# Altium schematic sheet power.SchDoc
size 209 x 297 mm; SheetNumber: 2; SheetTotal: 2
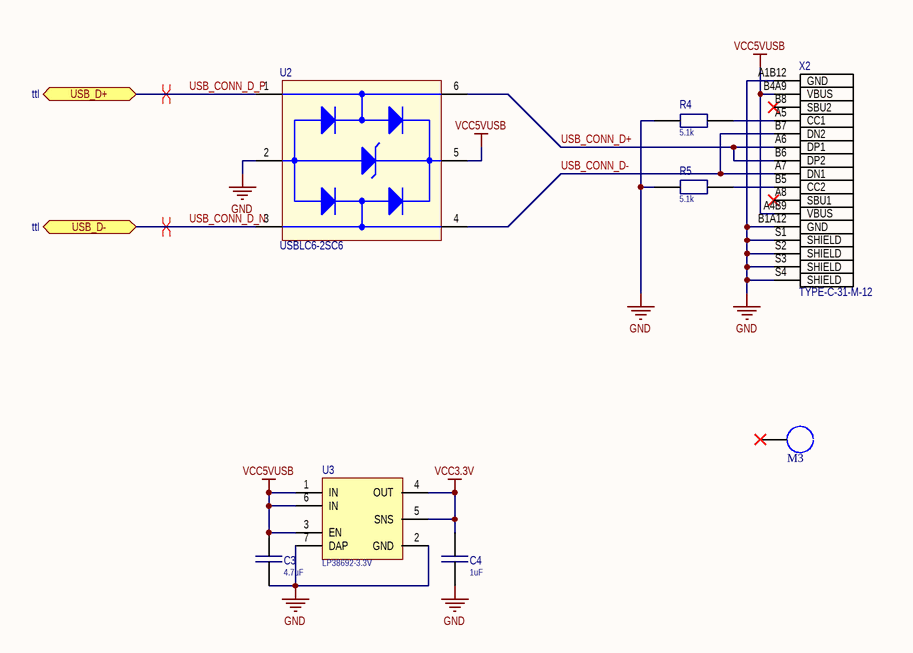
[diagram p0: power.SchDoc]

## Parts
*1  M3  [M3]  (no BOM)
C3  4.7uF  [C_0603]
C4  1uF  [C_0603]
R4  5.1k  [R_0603]
R5  5.1k  [R_0603]
U2  USBLC6-2SC6  [SOT95P280X145-6N]
U3  LP38692-3.3V  [WSON-6]
X2  TYPE-C-31-M-12  [HRO_TYPE-C-31-M-12]

## Ports
USB_D+ (bidir, see ttl), USB_D- (bidir, see ttl)

## Nets
GND: C3.1 C4.1 R4.1 R5.1 U2.2(GND) U3.2(GND) U3.7(DAP) X2.A1B12(GND) X2.B1A12(GND) X2.S1(SHIELD) X2.S2(SHIELD) X2.S3(SHIELD) X2.S4(SHIELD)
VCC3.3V: C4.2 U3.4(OUT) U3.5(SNS)
VCC5VUSB: C3.2 U2.5(VBUS) U3.1(IN) U3.3(EN) U3.6(IN) X2.A4B9(VBUS) X2.B4A9(VBUS)
USB_CONN_D+: U2.6(I/O1_OUT) X2.A6(DP1) X2.B6(DP2)
USB_CONN_D-: U2.4(I/O2_OUT) X2.A7(DN1) X2.B7(DN2)
USB_CONN_D_N: U2.3(I/O2_IN) ; port USB_D-
USB_CONN_D_P: U2.1(I/O1_IN) ; port USB_D+
NetR4_2: R4.2 X2.A5(CC1)
NetR5_2: R5.2 X2.B5(CC2)

Not connected (* = marked no-connect by the designer): *1 1*; X2 A8(SBU1)* B8(SBU2)*

## Layout directives
differential pair: USB_CONN_D_N, USB_CONN_D_P

## Library data of the parts
C3 = CAP_SMD: Capacitor; Part Number: CC0603KRX5R6BB475; Alternative Part: *; Value: 4.7uF
C4 = CAP_SMD: Capacitor; Part Number: CC0603ZRY5V7BB105; Alternative Part: *; Value: 1uF
R4 R5 = RES_SMD: Resistor; Part Number: RC0603FR-075K1L; Alternative Part: *; Value: 5.1k
U2 = USBLC6-2SC6: 17V Clamp 5A (8/20Âµs) Ipp Tvs Diode Surface Mount SOT-23-6; MF: STMicroelectronics; Value: *; Check_prices: https://www.snapeda.com/parts/USBLC6-2SC6/STMicroelectronics/view-part/?ref=eda; MP: USBLC6-2SC6; Purchase-URL: https://pricing.snapeda.com/search/part/USBLC6-2SC6/?ref=eda; Price: None; Availability: In Stock; Package: SOT-23-6 STMicroelectronics; SnapEDA_Link: https://www.snapeda.com/parts/USBLC6-2SC6/STMicroelectronics/view-part/?ref=snap; Part Number: USBLC6-2SC6; Alternative Part: *
U3 = LP38692: LP38690, LP38692 1-A LDO CMOS Linear Regulators  Stable with Ceramic Output Capacitors
X2 = TYPE-C-31-M-12: USB Connectors 24 Receptacle 1 8.94*7.3mm RoHS; Package: None; Availability: Unavailable; Value: *; MP: TYPE-C-31-M-12; Price: None; Part Number: TYPE-C-31-M-12; Alternative Part: *